# EasyEDA Pro project OSC1.eprj, board CH1/2
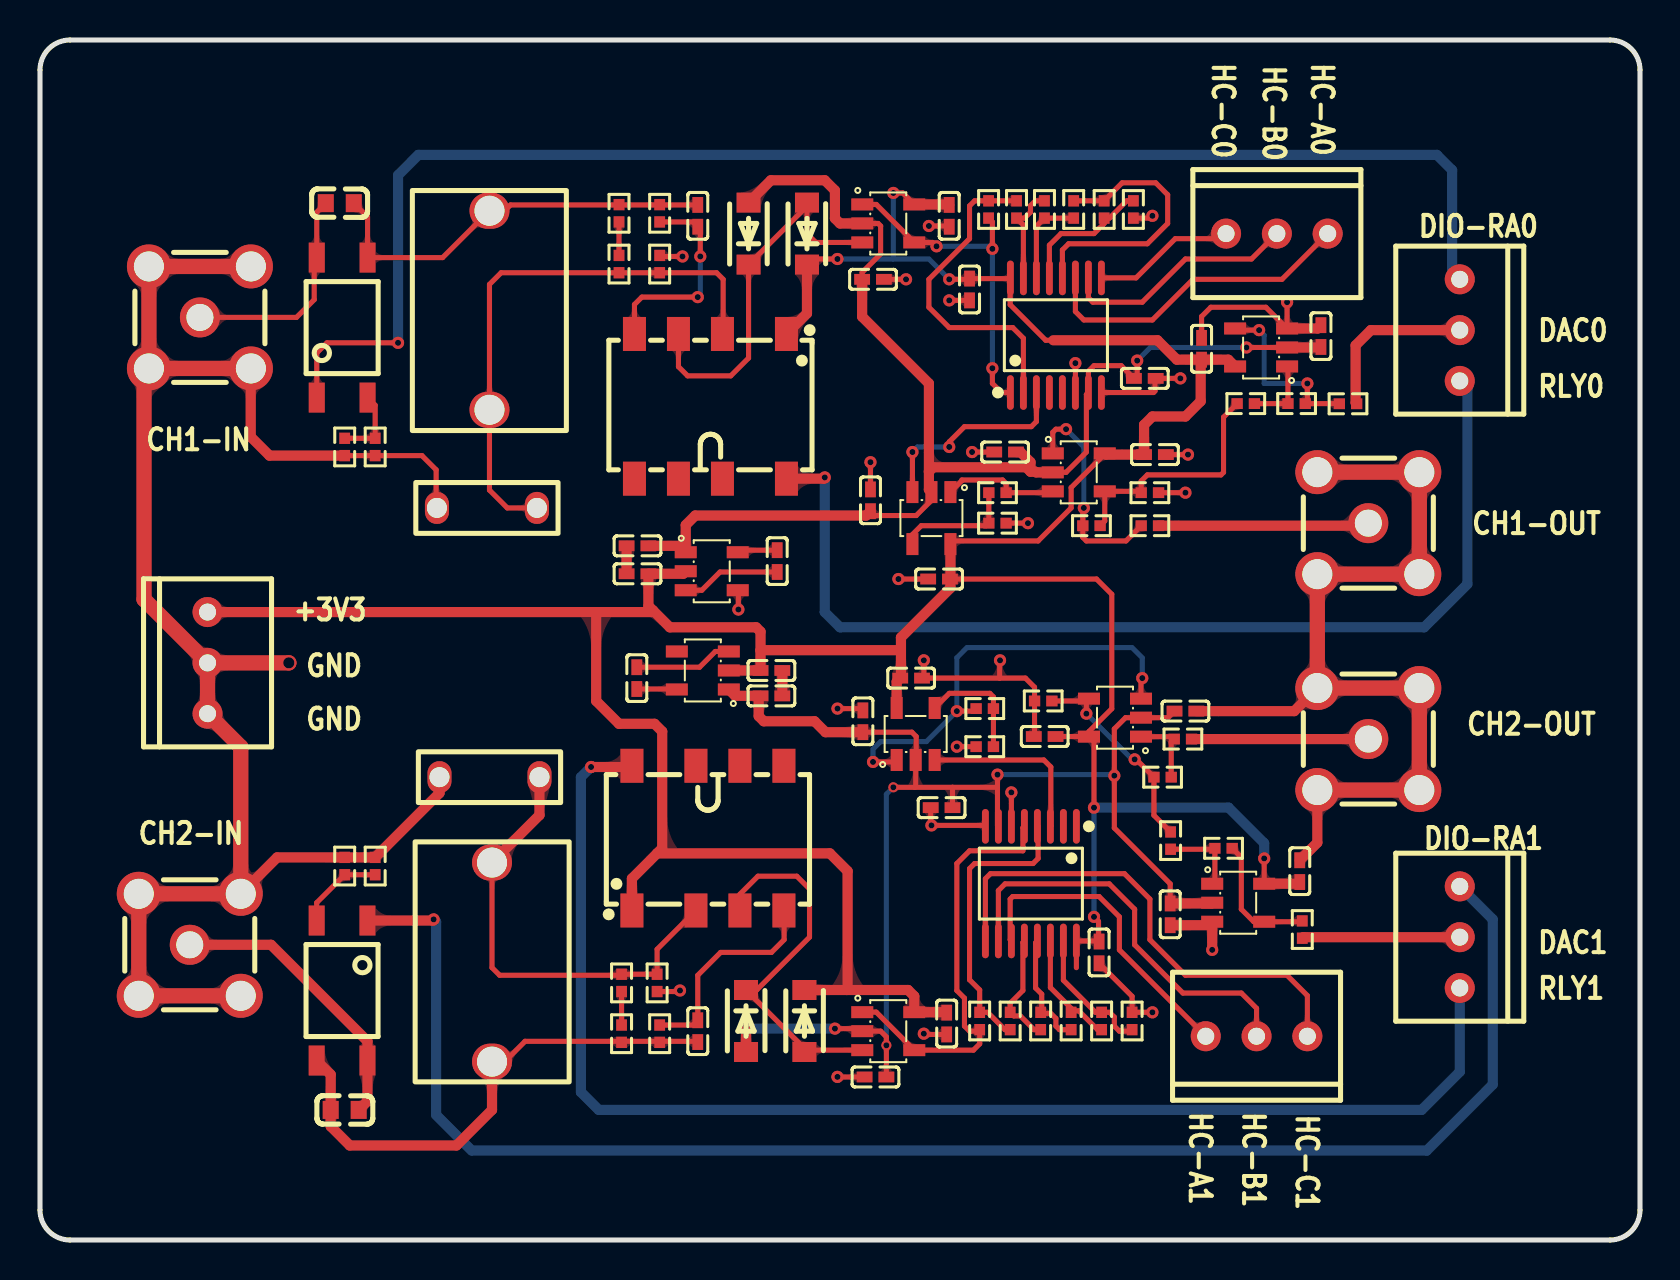
[diagram p19: board, top side]
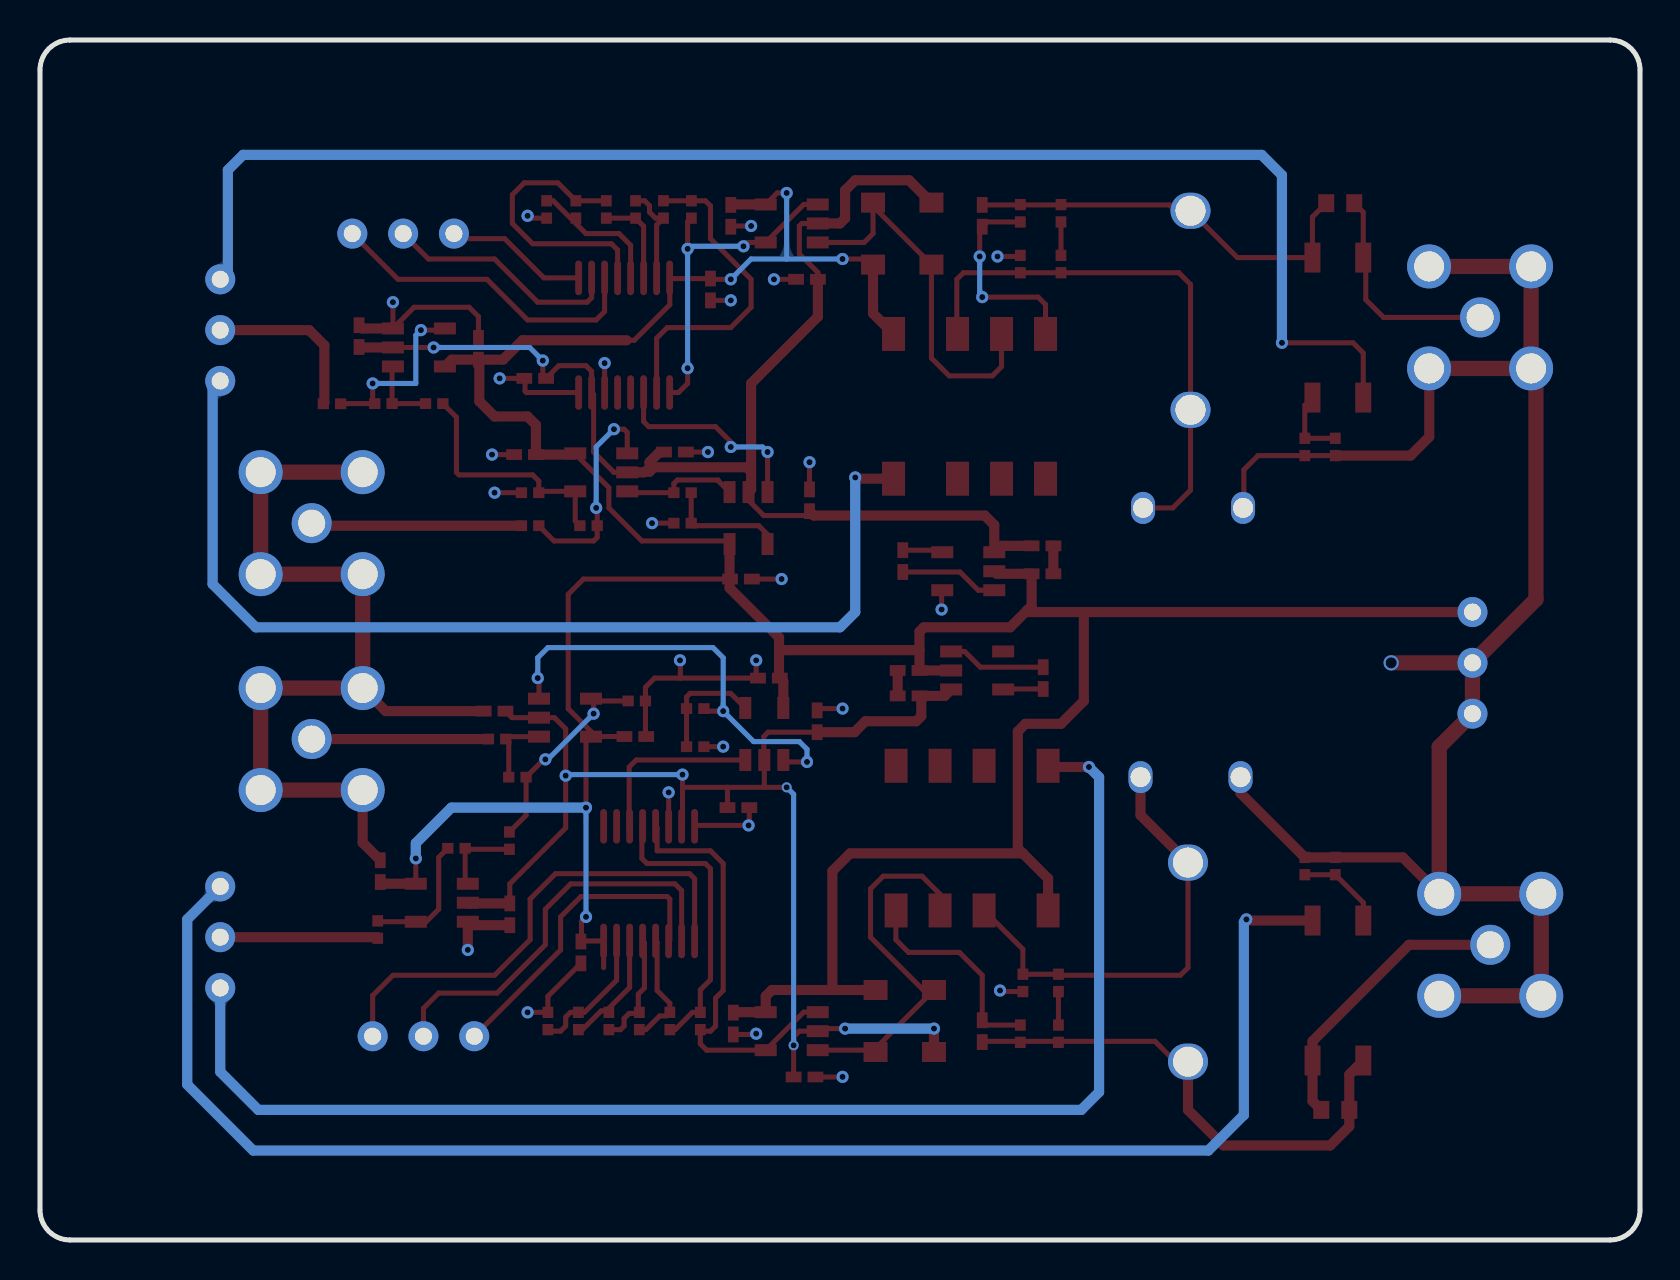
[diagram p20: board, bottom side, seen from below]

Outline 80 x 60 mm; copper layers: Top Layer, Bottom Layer. Coordinates in mm from the lower left corner of the outline.
Outline path: 0,58.5 0,1.5 arc(0.44,0.44) 1.5,0 78.5,0 arc(79.56,0.44) 80,1.5 80,58.5 arc(79.56,59.56) 78.5,60 1.5,60 arc(0.44,59.56) 0,58.5
Stack: Top Layer 0.035mm / Dielectric1 1.51mm FR4 er 4.5 / Bottom Layer 0.035mm

## Design rules (mm)
template: 自定义配置
spacing copperThickness1oz (default): track to track 0.203, other pairs 0.203 to 0.203
spacing copperThickness2oz: track to track 0.203, other pairs 0.152 to 0.3
track width copperThickness1oz (default): min 0.127, default 0.254, max 2.54
track width copperThickness2oz: min 0.203, default 0.254, max 2.54
track width trackWidth1: min 0.254, default 0.762, max 2.54
differential pair differentialPair (default): width min 0.127, default 0.254, max 2.54; gap min 0.152, default 0.152
via viaSize (default): diameter min 0.5, default 0.61, max 10; hole min 0.3, default 0.305, max 6.299
net GND uses trackWidth1
net -3V3 uses trackWidth1
net +3V3 uses trackWidth1

## Placement (name value [footprint] x y rotation side)
C1  22nF  [C0603]  14.99 51.84 0 top
C2  100nF  [C0402]  41.65 48.03 0 top
C3  10nF  [C0402]  32.89 51.21 270 top
C4  120P  [280*100mil]  22.35 36.6 0 top
C5  100nF  [C0402]  45.46 51.21 270 top
C6  100nF  [C0402]  46.48 47.53 90 top
C7  100nF  [C0402]  41.52 36.98 90 top
C8  100nF  [C0402]  48.25 39.4 180 top
C9  100nF  [C0402]  55.24 43.08 180 top
C10  100nF  [C0402]  64.05 45.2 90 top
C11  100nF  [C0402]  44.95 33.05 180 top
C12  100nF  [C0402]  55.75 39.27 0 top
C13  100nF  [C0402]  58.08 44.56 90 top
C14  22nF  [C0603]  15.23 6.5 180 top
C15  100nF  [C0402]  41.77 8.15 180 top
C16  10nF  [C0402]  32.89 10.44 90 top
C17  120P  [280*100mil]  22.47 23.14 0 top
C18  100nF  [C0402]  45.33 10.82 270 top
C19  100nF  [C0402]  52.95 14.38 90 top
C20  100nF  [C0402]  41.14 25.94 90 top
C21  100nF  [C0402]  57.27 26.44 0 top
C22  100nF  [C0402]  45.08 21.62 0 top
C23  100nF  [C0402]  56.51 16.28 270 top
C24  100nF  [C0402]  43.56 28.09 0 top
C25  100nF  [C0402]  50.23 25.17 180 top
C26  100nF  [C0402]  62.99 18.44 90 top
C27  1uF  [C0402]  36.86 33.95 90 top
C28  1uF  [C0402]  29.88 34.71 0 top
C29  1uF  [C0402]  29.88 33.31 0 top
C30  1uF  [C0402]  29.84 28.09 270 top
C31  1uF  [C0402]  36.57 27.21 180 top
C32  1uF  [C0402]  36.57 28.48 180 top
D1  SM4007PL  [SOD-123F_L2.8-W1.8-LS3.7-RD]  35.43 50.32 90 top
D2  SM4007PL  [SOD-123F_L2.8-W1.8-LS3.7-RD]  38.35 50.32 90 top
D3  SM4007PL  [SOD-123F_L2.8-W1.8-LS3.7-RD]  35.3 10.95 270 top
D4  SM4007PL  [SOD-123F_L2.8-W1.8-LS3.7-RD]  38.22 10.95 270 top
J1  -  [CH2.54-3插座]  70.99 45.49 270 top
J2  -  [CH2.54-3插座]  61.84 50.32 0 top
J3  -  [CH2.54-3插座]  70.99 15.14 270 top
J4  -  [CH2.54-3插座]  60.83 10.19 180 top
J5  -  [CH2.54-3插座]  8.38 28.86 90 top
K1  G6K-2F-Y DC3  [RELAY-SMD_G6K-2F-Y]  33.52 41.68 180 top
K2  G6K-2F-Y DC3  [RELAY-SMD_G6K-2F-Y]  33.4 20.09 0 top
R1  510kΩ  [R0402]  30.98 51.34 90 top
R2  510kΩ  [R0402]  28.95 51.34 90 top
R3  470kΩ  [R0402]  28.95 48.8 90 top
R4  49.9Ω  [R0402]  47.43 51.53 90 top
R5  24.9Ω  [R0402]  48.83 51.53 270 top
R6  4.99Ω  [R0402]  50.22 51.53 270 top
R7  10Ω  [R0402]  51.68 51.53 90 top
R8  4.99Ω  [R0402]  53.21 51.53 270 top
R9  4.99Ω  [R0402]  54.67 51.53 270 top
R10  20kΩ  [R0402]  30.98 48.8 270 top
R11  1kΩ  [R0402]  15.23 39.65 90 top
R12  1kΩ  [R0402]  16.76 39.65 90 top
R13  22Ω  [R0402]  55.49 35.72 0 top
R14  82Ω  [R0402]  47.87 35.84 180 top
R15  180Ω  [R0402]  47.87 37.37 0 top
R16  180Ω  [R0402]  55.49 37.37 180 top
R17  220Ω  [R0402]  52.57 35.72 180 top
R18  220Ω  [R0402]  60.29 41.82 180 top
R19  220Ω  [R0402]  65.4 41.81 180 top
R20  220Ω  [R0402]  62.83 41.82 180 top
R21  510kΩ  [R0402]  30.98 10.31 270 top
R22  510kΩ  [R0402]  29.08 10.31 270 top
R23  470kΩ  [R0402]  29.08 12.86 270 top
R24  49.9Ω  [R0402]  46.98 10.95 90 top
R25  24.9Ω  [R0402]  48.51 10.95 90 top
R26  4.99Ω  [R0402]  50.03 10.95 90 top
R27  10Ω  [R0402]  51.56 10.95 90 top
R28  4.99Ω  [R0402]  53.08 10.95 90 top
R29  4.99Ω  [R0402]  54.6 10.95 90 top
R30  20kΩ  [R0402]  30.86 12.86 90 top
R31  1kΩ  [R0402]  15.23 18.7 270 top
R32  1kΩ  [R0402]  16.76 18.7 270 top
R33  22Ω  [R0402]  57.15 25.05 0 top
R34  82Ω  [R0402]  47.24 24.67 0 top
R35  180Ω  [R0402]  47.24 26.57 180 top
R36  180Ω  [R0402]  50.16 26.95 0 top
R37  220Ω  [R0402]  56.13 23.14 0 top
R38  220Ω  [R0402]  56.53 19.97 90 top
R39  220Ω  [R0402]  63.11 15.52 90 top
R40  220Ω  [R0402]  59.18 19.59 180 top
RF1  BWSMA-KE-Z001  [SMA-TH_BWSMA-KE-Z001]  8 46.13 0 top
RF2  BWSMA-KE-Z001  [SMA-TH_BWSMA-KE-Z001]  66.42 35.84 180 top
RF3  BWSMA-KE-Z001  [SMA-TH_BWSMA-KE-Z001]  7.49 14.76 0 top
RF4  BWSMA-KE-Z001  [SMA-TH_BWSMA-KE-Z001]  66.42 25.05 0 top
U1  0-50uf  [可调电容]  22.47 46.51 90 top
U2  TLP172GM(TPL,E(O  [SMD-4_L4.6-W3.7-P2.54-LS7.0-BR]  15.11 45.62 270 top
U3  GS8091-TR  [SOT-23-5_L3.0-W1.7-P0.95-LS2.8-BR]  42.41 50.83 180 top
U4  74HC4051PW,118  [TSSOP-16_L5.0-W4.4-P0.65-LS6.4-BL]  50.79 45.24 0 top
U5  GS8091-TR  [SOT-23-5_L3.0-W1.7-P0.95-LS2.8-BR]  44.57 36.1 90 top
U6  GS8091-TR  [SOT-23-5_L3.0-W1.7-P0.95-LS2.8-BR]  51.94 38.38 180 top
U7  GS8091-TR  [SOT-23-5_L3.0-W1.7-P0.95-LS2.8-BR]  61.05 44.63 0 top
U8  0-50uf  [可调电容]  22.6 13.87 270 top
U9  TLP172GM(TPL,E(O  [SMD-4_L4.6-W3.7-P2.54-LS7.0-BR]  15.1 12.47 90 top
U10  GS8091-TR  [SOT-23-5_L3.0-W1.7-P0.95-LS2.8-BR]  42.41 10.44 180 top
U11  74HC4051PW,118  [TSSOP-16_L5.0-W4.4-P0.65-LS6.4-BL]  49.54 17.82 180 top
U12  GS8091-TR  [SOT-23-5_L3.0-W1.7-P0.95-LS2.8-BR]  43.78 25.3 270 top
U13  GS8091-TR  [SOT-23-5_L3.0-W1.7-P0.95-LS2.8-BR]  53.75 26.12 0 top
U14  GS8091-TR  [SOT-23-5_L3.0-W1.7-P0.95-LS2.8-BR]  59.91 16.86 180 top
U15  TPS60400DBVR  [SOT-23-5_L3.0-W1.7-P0.95-LS2.8-BR]  33.59 33.44 180 top
U16  TPS60400DBVR  [SOT-23-5_L3.0-W1.7-P0.95-LS2.8-BR]  33.14 28.48 0 top

## Footprints (pads in the part's own frame, mm; a bottom-side part is the same pattern mirrored in y, then rotated)
280*100mil
  oval 1.2x1.6 hole 1x0.8: 1(-2.5,0) 2(2.5,0)
C0402
  rect 0.79x0.54 smd: 1(-0.545,0) 2(0.545,0)
C0603
  rect 0.8x0.9 smd: 1(-0.7,0) 2(0.7,0)
CH2.54-3插座
  round 1.5 hole 0.85: 1(-2.54,0) 2(0,0) 3(2.54,0)
R0402
  rect 0.566x0.54 smd: 1(-0.433,0) 2(0.433,0)
RELAY-SMD_G6K-2F-Y
  rect 1.15x1.7 smd: 1(-3.8,-3.618) 2(-0.6,-3.618) 3(1.6,-3.618) 4(3.8,-3.618) 5(3.8,3.618) 6(1.6,3.618) 7(-0.6,3.618) 8(-3.8,3.618)
SMA-TH_BWSMA-KE-Z001
  round 2.2 hole 1.5: 1(-2.55,-2.55) 2(-2.55,2.55) 3(2.55,2.55) 4(2.55,-2.55)
  round 2 hole 1.35: 5(0,0)
SMD-4_L4.6-W3.7-P2.54-LS7.0-BR
  rect 1.5x0.8 smd: 1(3.5,-1.27) 2(3.5,1.27) 3(-3.5,1.27) 4(-3.5,-1.27)
SOD-123F_L2.8-W1.8-LS3.7-RD
  rect 1x1.2 smd: 1(-1.55,0) 2(1.55,0)
SOT-23-5_L3.0-W1.7-P0.95-LS2.8-BR
  rect 1.1x0.6 smd: 1(1.3,-0.95) 2(1.3,0) 3(1.3,0.95) 4(-1.3,0.95) 5(-1.3,-0.95)
TSSOP-16_L5.0-W4.4-P0.65-LS6.4-BL
  oval 0.343x1.732 smd: 1(-2.275,-2.866) 2(-1.625,-2.866) 3(-0.975,-2.866) 4(-0.325,-2.866) 5(0.325,-2.866) 6(0.975,-2.866) 7(1.625,-2.866) 8(2.275,-2.866) 9(2.275,2.866) 10(1.625,2.866) 11(0.975,2.866) 12(0.325,2.866) 13(-0.325,2.866) 14(-0.975,2.866) 15(-1.625,2.866) 16(-2.275,2.866)
可调电容
  oval 1.8x2 hole 1.5: 1(-5,0) 2(4.953,0)

## Nets
As in the schematic, except:
INPUT1: C1.1 RF1.5 U2.4
INPUT2: C14.1 RF3.5 U9.4

Pads without a net: K1 5 6 7; K2 5 6 7; U4 4 5; U11 1 2

## Via types
v1: diameter 0.61, hole 0.305, Top Layer to Bottom Layer, 58 vias
v2: diameter 0.762, hole 0.559, Top Layer to Bottom Layer, 1 via
v3: diameter 0.5, hole 0.305, Top Layer to Bottom Layer, 2 vias

## Routing (per net, layer and track width the routed paths; a pad name or vN(x,y) marks a point on that pad's centre or on a via; arc(x,y) is an arc through that point)
+3V3: length 191.5
  Top Layer w0.254: 50.67,44.99 50.29,44.99 48.51,46.76 48.51,48.09 ; 48.51,48.09 U4.16 ; 48.51,48.09 48.49,48.07 C6.2 46.44,48.03 v1(45.46,48.03) ; 45.52,33.05 52.83,33.05 53.59,32.29 53.59,26.56 52.45,25.42 U13.5 ; D2.1 38.63,49.05 v1(39.87,49.05) ; U14.5 61.21,19.08 ; v1(52.7,21.62) 52.7,24.92 U13.5 ; 51.82,13.62 U11.16 52.93,14.95 ; U13.5 52.44,25.17 C25.1 ; v1(52.7,16.16) 52.93,15.93 52.93,14.95 ; 52.93,14.95 C19.2 ; v1(42.67,52.35) 43.14,52.35 43.71,51.78 ; U6.5 53.24,39.3 51.56,37.62 51.56,36.6 49.91,34.95 45.68,34.95 U5.5
  Top Layer w0.508: 27.84,31.4 27.81,31.37 27.81,26.95 28.95,25.81 30.73,25.81 31.11,25.43 31.11,19.59 30.86,19.33 ; 27.84,31.4 30.56,31.4 30.65,31.48 ; 27.84,31.4 J5.3 ; 50.67,44.99 55.88,44.99 56.84,44.02 C13.1 ; 36.03,29.48 36.03,30.42 35.81,30.64 31.49,30.64 30.65,31.48 ; 36.03,29.48 36.04,29.49 43.04,29.49 43.05,29.5 ; 36.03,29.48 C32.2 U16.2 ; 30.65,31.48 30.42,31.71 C29.2 32.16,33.31 32.29,33.44 ; 30.86,19.33 29.6,18.07 K2.1 ; 30.86,19.33 39.49,19.33 40.38,18.44 40.38,12.54 40.34,12.5 ; D4.1 40.34,12.5 ; 40.34,12.5 43.4,12.5 43.71,12.19 43.71,11.39 45.31,11.39 C18.1 ; D2.1 38.35,46.33 K1.1 ; 43.05,29.5 43.05,28.13 C24.1 42.83,27.92 U12.5 ; 43.05,29.5 43.05,30.13 45.52,32.6 45.52,33.07 ; C11.1 45.52,33.07 ; 45.52,33.07 U5.5 ; C5.1 45.44,51.78 43.71,51.78 ; U7.5 59.41,44.02 C13.1 ; C13.1 58.03,43.97 58.03,41.94 57.27,41.18 55.62,41.18 55.2,40.76 C12.1 53.3,39.27 U6.5 ; C26.1 62.9,17.81 U14.5
  Bottom Layer w0.254: 39.75,48.92 v1(39.87,49.05) 42.67,49.05 ; 42.67,49.05 v1(42.67,52.35) ; 42.67,49.05 44.44,49.05 v1(45.46,48.03) ; v1(52.7,21.62) v1(52.7,16.16)
  Bottom Layer w0.508: v1(61.21,19.08) 61.21,19.84 59.43,21.62 v1(52.7,21.62)
-3V3: length 67.8
  Top Layer w0.254: v1(54.86,43.97) 54.86,43.25 C9.2 54.06,43.72 52.7,43.72 52.42,43.44 U4.7 52.32,42.27 52.32,39.4 51.3,38.38 U6.2 ; U7.2 v1(60.32,44.63) ; U3.2 41.91,50.83 42.03,50.7 42.03,49.3 41.11,48.38 C2.1 ; U5.2 44.57,36.98 43.81,36.22 41.74,36.22 C7.1
  Top Layer w0.508: U5.2 44.44,37.52 44.44,38.42 ; 49.52,38.42 49.76,38.42 49.8,38.38 U6.2 ; 49.52,38.42 49.52,38.89 49.02,39.4 C8.1 ; 49.52,38.42 49.31,38.64 44.66,38.64 44.44,38.42 ; C2.1 41.11,46.17 44.44,42.83 44.44,38.42 ; C10.1 64.02,44.63 U7.2 ; U3.2 40,50.83 39.75,51.08 39.75,52.48 39.24,52.99 36.54,52.99 D1.2 ; C7.1 41.31,36.22 32.76,36.22 32.29,35.75 32.29,34.39 31.97,34.71 C28.2
  Bottom Layer w0.254: v1(54.86,43.97) 55.51,44.63 v1(60.32,44.63)
-3V3-CH2: length 67.1
  Top Layer w0.254: v1(39.75,10.57) 40.99,10.57 U10.2 42.03,10.44 42.32,10.16 v3(42.32,9.73) C15.1 ; 56.51,16.83 56.51,17.81 53.72,20.6 v1(53.72,23.22) 53.72,25.56 54.28,26.12 U13.2 56.4,26.12 C21.1 ; 45.63,22.63 45.62,22.63 C22.2 ; 45.63,22.63 47.87,22.63 ; 45.63,22.63 43.74,22.63 ; 47.87,22.63 v1(47.87,23.27) ; 47.87,22.63 47.87,20.73 U11.7 ; C20.1 43.59,25.39 43.81,25.17 43.81,24.03 U12.2 43.78,22.68 43.74,22.63 ; 43.74,22.63 v3(42.67,22.63)
  Top Layer w0.508: C20.1 39.28,25.39 38.73,25.94 36.19,25.94 35.94,26.19 35.94,27.12 C31.2 34.76,27.21 U16.1 ; U14.2 58.57,16.83 56.51,16.83 ; D3.2 v1(35.3,10.57)
  Bottom Layer w0.254: v3(42.67,22.63) 42.32,22.29 v3(42.32,9.73) ; v1(47.87,23.27) 53.66,23.27 v1(53.72,23.22)
  Bottom Layer w0.508: v1(35.3,10.57) v1(39.75,10.57)
GND: length 197.9
  Top Layer w0.254: C18.2 44.32,10.28 ; 56.76,43.08 C9.1 55.75,43.04 55.75,42.45 55.68,42.37 U4.8 ; 47.98,28.09 47.98,28.86 ; 47.98,28.09 49.27,28.09 49.73,27.64 R36.1 49.73,25.21 49.69,25.17 ; 47.98,28.09 C24.2 44.19,28.19 v1(44.19,28.98) ; v1(44.44,50.7) 45.42,50.7 C5.2 ; R16.1 57.15,37.37 57.27,37.49 ; U4.6 v1(51.77,43.84) ; v1(62.35,46.89) U7.3 61.29,46.64 58.54,46.64 58.08,46.17 C13.2 ; 47.27,20.68 47.22,20.73 v1(44.57,20.73) 44.53,20.77 C22.1 ; C19.1 54.6,12.18 54.6,11.38 v1(55.62,11.38) ; R9.2 55.51,51.09 v1(55.62,51.21) ; v1(34.92,31.52) 34.92,32.46 U15.4 ; C15.2 39.88,8.15 v1(39.87,8.16) ; 41.14,26.48 41.05,26.57 v1(39.87,26.57) ; R14.1 v1(49.4,35.84) ; R11.1 R12.1 19.1,39.22 19.81,38.51 19.81,36.64 C4.1 ; v1(43.3,48.03) C2.2 ; C8.2 v1(46.6,39.4) ; C12.2 v1(57.4,39.27) ; C11.2 v1(42.92,33.05) ; C6.1 v1(45.46,46.98) ; 48.57,20.68 v1(48.57,22.38) ; R30.1 31.87,12.42 ; C7.2 v1(41.52,38.89) ; v1(32.13,49.18) 31.03,49.18 30.98,49.23 ; R34.1 v1(45.84,24.67)
  Top Layer w0.508: C26.2 63.87,19.87 RF4.1 ; C32.1 C31.1 ; C23.2 58.43,15.74 U14.3 v1(58.61,14.51) ; C29.1 C28.1 ; C17.1 19.97,22.34 R32.1 R31.1 11.86,19.13 RF3.3 ; R11.1 11.48,39.22 10.54,40.16 10.54,43.57 RF1.4 ; C10.2 63.88,45.58 U7.3 ; RF4.2 62.71,26.44 C21.2
  Top Layer w0.762: J5.2 J5.1 10.04,24.66 RF3.3 RF3.2 RF3.1 RF3.4 ; J5.2 v2(12.44,28.86) ; J5.2 5.2,32.03 5.2,43.33 RF1.1 ; RF4.1 RF4.4 RF4.3 RF4.2 RF2.3 RF2.2 RF2.1 RF2.4 ; RF1.4 RF1.1 ; RF1.1 RF1.2 RF1.3
  vias: v1(32,12.47) v1(44.19,10.31) v1(48,28.98) v1(57.02,43.08) v1(57.27,37.37)
CH1-0: length 16.9
  Top Layer w0.254: U3.1 41.81,51.78 43.71,49.88 44.63,49.88 v1(44.83,49.69) ; v1(47.62,43.59) 47.62,42.83 48.07,42.37 U4.1 ; R4.1 47.62,50.9 v1(47.62,49.56)
  Bottom Layer w0.254: v1(47.62,43.59) v1(47.62,49.56) 47.49,49.69 v1(44.83,49.69)
CH1-1: length 16.4
  Top Layer w0.254: U4.2 49.17,45.09 48.64,45.62 45.46,45.62 44.44,46.64 44.44,48.03 46.48,50.07 46.48,51.71 46.73,51.96 R4.2 R5.1
CH1-2: length 5.1
  Top Layer w0.254: R6.1 49.77,51.96 49.53,51.72 49.53,51.39 49.22,51.09 R5.2 49.17,50.75 U4.15
CH1-3: length 4.6
  Top Layer w0.254: U4.14 49.82,50.69 R6.2 R7.1
CH1-4: length 14
  Top Layer w0.254: U4.12 51.12,49.5 51.43,49.81 55.37,49.81 56.38,50.83 56.38,52.26 55.78,52.86 54.11,52.86 R8.1 R7.2
CH1-5: length 6.9
  Top Layer w0.254: R9.1 54.34,51.96 53.47,51.09 R8.2 53.21,50.83 52.7,50.32 51.05,50.32 50.47,49.74 U4.13
CH1-OUT: length 10.5
  Top Layer w0.508: R13.2 66.29,35.72 RF2.5
CH2-0: length 21.5
  Top Layer w0.254: U10.1 41.81,11.39 43.71,9.49 46.67,9.49 46.99,9.81 46.99,10.51 R24.1 46.91,10.44 46.48,10.44 46.22,10.7 46.22,12.09 45.84,12.47 45.84,18.82 46.48,19.46 49.14,19.46 49.14,20.61 U11.5
CH2-1: length 14.5
  Top Layer w0.254: R25.1 48.25,10.52 47.38,11.38 46.98,11.38 46.98,12.5 46.48,13.01 46.48,18.57 46.73,18.82 49.65,18.82 49.91,19.08 49.91,20.69
CH2-2: length 5.7
  Top Layer w0.254: U11.12 49.14,14.88 49.14,12.47 48.51,11.84 48.51,11.38 48.69,11.2 49.02,11.2 49.7,10.52 R26.1
CH2-3: length 5.9
  Top Layer w0.254: R27.1 50.97,10.52 50.79,10.7 50.79,11.08 50.54,11.33 50.09,11.33 ; 50.09,11.33 50.03,11.38 ; 50.09,11.33 50.09,12.3 49.78,12.6 49.78,14.86 49.87,14.95
CH2-4: length 5.9
  Top Layer w0.254: U11.14 50.52,12.62 51.56,11.59 51.56,11.38 51.63,11.46 51.94,11.46 52.88,10.52 R28.1
CH2-5: length 6.7
  Top Layer w0.254: U11.15 51.17,12.99 52.78,11.38 53.48,11.38 53.72,11.15 53.72,10.7 53.97,10.44 54.53,10.44 R29.1
CH2-OUT: length 8.8
  Top Layer w0.508: R33.2 RF4.5
DAC0: length 8.5
  Top Layer w0.508: R19.1 65.78,41.86 65.78,44.73 66.54,45.49 J1.2
DAC1: length 7.9
  Top Layer w0.508: J3.2 63.17,15.14 R39.1
DIO-RA0: length 73.9
  Top Layer w0.254: U2.1 13.84,44.35 14.35,44.86 v1(17.9,44.86)
  Bottom Layer w0.508: v1(17.9,44.86) 17.9,53.24 18.92,54.26 69.84,54.26 70.61,53.5 70.61,48.42 J1.1
DIO-RA1: length 78.7
  Top Layer w0.508: v1(19.68,16.03) 19.62,15.97 U9.1
  Bottom Layer w0.508: 70.99,17.68 72.64,16.03 72.64,7.78 69.34,4.47 21.59,4.47 19.81,6.25 19.81,15.9 v1(19.68,16.03)
HC-A0: length 16.3
  Top Layer w0.254: U4.11 51.77,46.42 52.19,46 55.62,46 57.65,48.03 62.1,48.03 J2.3
HC-A1: length 15.8
  Top Layer w0.254: J4.3 53.97,14.51 53.97,16.16 52.95,17.17 48.64,17.17 48.51,17.05 48.51,15.01 48.57,14.95
HC-B0: length 11.9
  Top Layer w0.254: U4.10 52.42,47.11 52.64,46.89 55.11,46.89 57.27,49.05 60.57,49.05 J2.2
HC-B1: length 20.6
  Top Layer w0.254: J4.2 60.83,11.59 60.07,12.35 57.15,12.35 54.73,14.76 54.73,16.54 53.46,17.81 48.25,17.81 47.92,17.47 U11.10
HC-C0: length 7.2
  Top Layer w0.254: U4.9 54.8,48.11 56.76,50.07 59.05,50.07 J2.1
HC-C1: length 25.1
  Top Layer w0.254: 47.27,14.95 47.27,18.06 47.52,18.32 54.22,18.32 55.49,17.05 55.49,15.01 57.27,13.24 62.35,13.24 63.37,12.22 J4.1
INPUT1: length 11.1
  Top Layer w0.254: RF1.5 12.82,46.13 13.71,47.02 13.71,48.99 U2.4 13.84,51.39 C1.1
INPUT2: length 14.5
  Top Layer w0.508: RF3.5 11.55,14.76 16.37,9.94 U9.4 16.37,6.94 C14.1
OUT_HC0: length 10.4
  Top Layer w0.254: v1(45.46,39.65) 45.46,39.91 46.22,40.67 49.57,40.67 49.82,40.92 U4.3 ; U5.3 v1(43.62,39.4)
  Bottom Layer w0.254: v1(45.46,39.65) 43.88,39.65 v1(43.62,39.4)
OUT_HC1: length 8.9
  Top Layer w0.254: U11.3 50.54,20.7 50.54,23.65 50.19,24 U12.3
RLY0: length 52.3
  Top Layer w0.508: v1(39.24,38.13) 39.18,38.07 K1.8
  Bottom Layer w0.508: J1.3 71.37,42.57 71.37,32.79 69.21,30.64 40,30.64 39.24,31.4 v1(39.24,38.13)
RLY1: length 67.8
  Top Layer w0.508: K2.8 29.53,23.65 v1(27.55,23.65)
  Bottom Layer w0.508: v1(27.55,23.65) 27.05,23.14 27.05,7.39 27.94,6.5 69.08,6.5 70.99,8.41 J3.3
$1N1760: length 3.7
  Top Layer w0.254: 15.23,40.08 16.76,40.08 16.76,41.74 U2.2
$1N2407: length 27.8
  Top Layer w0.254: C4.2 23.36,36.6 22.47,37.49 U1.1 22.47,47.78 23.06,48.36 R3.1 R10.2 33.83,48.36 34.16,48.03 34.16,45.34 K1.2
$1N11061: length 19
  Top Layer w0.254: 38.35,51.69 D1.1 35.43,44.1 34.54,43.21 32.38,43.21 31.92,43.67 K1.3 ; 38.35,51.69 38.35,50.32 38.79,49.88 U3.3 ; 38.35,51.69 D2.2
$1N11884: length 5.9
  Top Layer w0.254: U6.3 50.57,37.37 R15.2 48.31,37.82 48.13,38 46.1,38 46.1,37.97 U5.1
$1N12026: length 10.7
  Top Layer w0.254: R13.1 54.3,34.95 52.32,34.95 52.14,35.13 R17.2 52.14,36.48 ; v1(51.3,40.54) 50.79,40.54 50.64,40.38 U6.1
  Bottom Layer w0.254: v1(52.19,36.6) 52.19,39.65 v1(51.3,40.54)
$1N12901: length 6.1
  Top Layer w0.254: R15.1 R14.2 47.31,35.72 44.06,35.72 43.62,35.27 U5.4
$1N12908: length 12.3
  Top Layer w0.254: R17.1 53.24,35.95 U6.4 55,37.43 R16.2 55.06,37.95 55.37,38.25 59.05,38.25 59.18,38.38 59.18,41.14 R18.2
$1N20167: length 20.6
  Top Layer w0.254: C1.2 16.38,51.15 U2.3 20.13,49.12 U1.2 23.24,51.46 23.53,51.75 C3.1
$1N20346: length 1.7
  Top Layer w0.254: 28.95,49.23 28.95,50.9
$1N20539: length 10.4
  Top Layer w0.254: v1(32.89,47.14) 30.09,47.14 29.72,46.77 29.72,45.3 ; v1(33.01,49.18) 33.01,50.54 C3.2 32.65,50.9 30.98,50.9
  Bottom Layer w0.254: v1(33.01,49.18) 33.01,47.27 v1(32.89,47.14)
$1N22217: length 8.9
  Top Layer w0.254: v1(60.96,45.49) 59.84,45.49 U7.4 ; R19.2 64.96,41.82 R20.1 63.37,41.93 v1(63.37,42.83)
  Bottom Layer w0.254: v1(60.96,45.49) 61.21,45.24 61.21,42.83 v1(63.37,42.83)
$1N22283: length 3.5
  Top Layer w0.254: R18.1 R20.2 62.4,43.63 U7.1
$6N4438: length 4.4
  Top Layer w0.254: U9.2 13.83,16.86 R31.2 R32.2
$6N4445: length 22.9
  Top Layer w0.254: K2.2 30.86,14.54 R30.2 R23.1 29.03,13.24 22.98,13.24 22.6,13.62 U8.1
  Top Layer w0.508: C17.2 24.97,21.24 U8.1
$6N4470: length 18.8
  Top Layer w0.254: U10.3 38.31,9.49 D4.2 38.22,9.58 D3.1 35.84,12.5 38.48,15.14 38.48,17.55 37.84,18.19 35.9,18.19 35,17.29 K2.3
$6N4490: length 22.2
  Top Layer w0.254: v1(55.11,28.09) 55.05,28.03 U13.3 ; v1(41.65,23.9) 42.74,23.9 U12.1 ; 46.81,26.44 v1(45.84,26.44)
  Bottom Layer w0.254: v1(55.11,28.09) 55.11,29.11 54.6,29.62 46.35,29.62 45.84,29.11 v1(45.84,26.44) 44.32,24.92 42.03,24.92 41.65,24.54 v1(41.65,23.9)
$6N4491: length 3.7
  Top Layer w0.254: U13.1 56.59,25.17 R33.1 56.56,24.9 R37.2
$6N4495: length 5.8
  Top Layer w0.254: U12.4 45.47,27.33 47.49,27.33 47.67,27.15 R35.1 R34.2
$6N4496: length 10.3
  Top Layer w0.254: v1(54.73,24.03) 54.81,24.03 R37.1 55.7,21.24 R38.2 ; v1(52.32,26.32) 52.32,26.94 52.33,26.95 ; 52.33,26.95 U13.4 ; 52.33,26.95 R36.2
  Bottom Layer w0.254: v1(52.32,26.32) 54.6,24.03 v1(54.73,24.03)
$6N4497: length 25.9
  Top Layer w0.254: 32.89,9.9 32.85,9.93 24.25,9.93 23.24,8.92 U8.2
  Top Layer w0.508: U8.2 22.6,6.5 20.82,4.73 15.49,4.73 14.53,5.68 C14.2 14.53,8.27 U9.3
$6N4505: length 1.7
  Top Layer w0.254: R22.1 R23.2
$6N4507: length 10.8
  Top Layer w0.254: R21.1 32.65,10.75 C16.2 32.89,13.24 34.03,14.38 36.57,14.38 37.21,15.01 37.21,16.47 K2.4
$6N4545: length 6.6
  Top Layer w0.254: R40.1 60.07,19.13 60.07,16.54 60.69,15.91 U14.4 63.07,15.91 R39.2
$6N4553: length 4.1
  Top Layer w0.254: R38.1 58.69,19.54 R40.2 58.74,17.95 U14.1
$7N308: length 2
  Top Layer w0.254: C27.2 34.99,34.49 U15.5
$7N311: length 5
  Top Layer w0.254: C27.1 34,33.4 33.09,32.49 32.29,32.49
$7N1156: length 2
  Top Layer w0.254: C30.2 31.82,27.55 U16.5
$7N1157: length 4.9
  Top Layer w0.254: C30.1 32.98,28.64 33.76,29.43 U16.3

## Copper pours and planes (outline as drawn; the poured copper is in the pictures)
GND on Top Layer: -4.7,62.39 82.42,62.39 82.42,-2.64 -4.7,-2.64
GND on Bottom Layer: -5.59,61.62 81.66,61.62 81.66,-2.13 -5.59,-2.13

Small or netless copper shapes (teardrops, artwork), in the pictures only: 430 on Top Layer, 35 on Bottom Layer

## Text on the board
Top Silkscreen Layer: CH2-IN | CH1-IN | +3V3 | GND | CH2-OUT | CH1-OUT | HC-A1 | HC-C0 | HC-B1 | HC-B0 | HC-C1 | HC-A0 | DIO-RA0 | DIO-RA1 | DAC0 | RLY0 | DAC1 | RLY1
